# EAGLE design AOA (EAGLE 4.16)
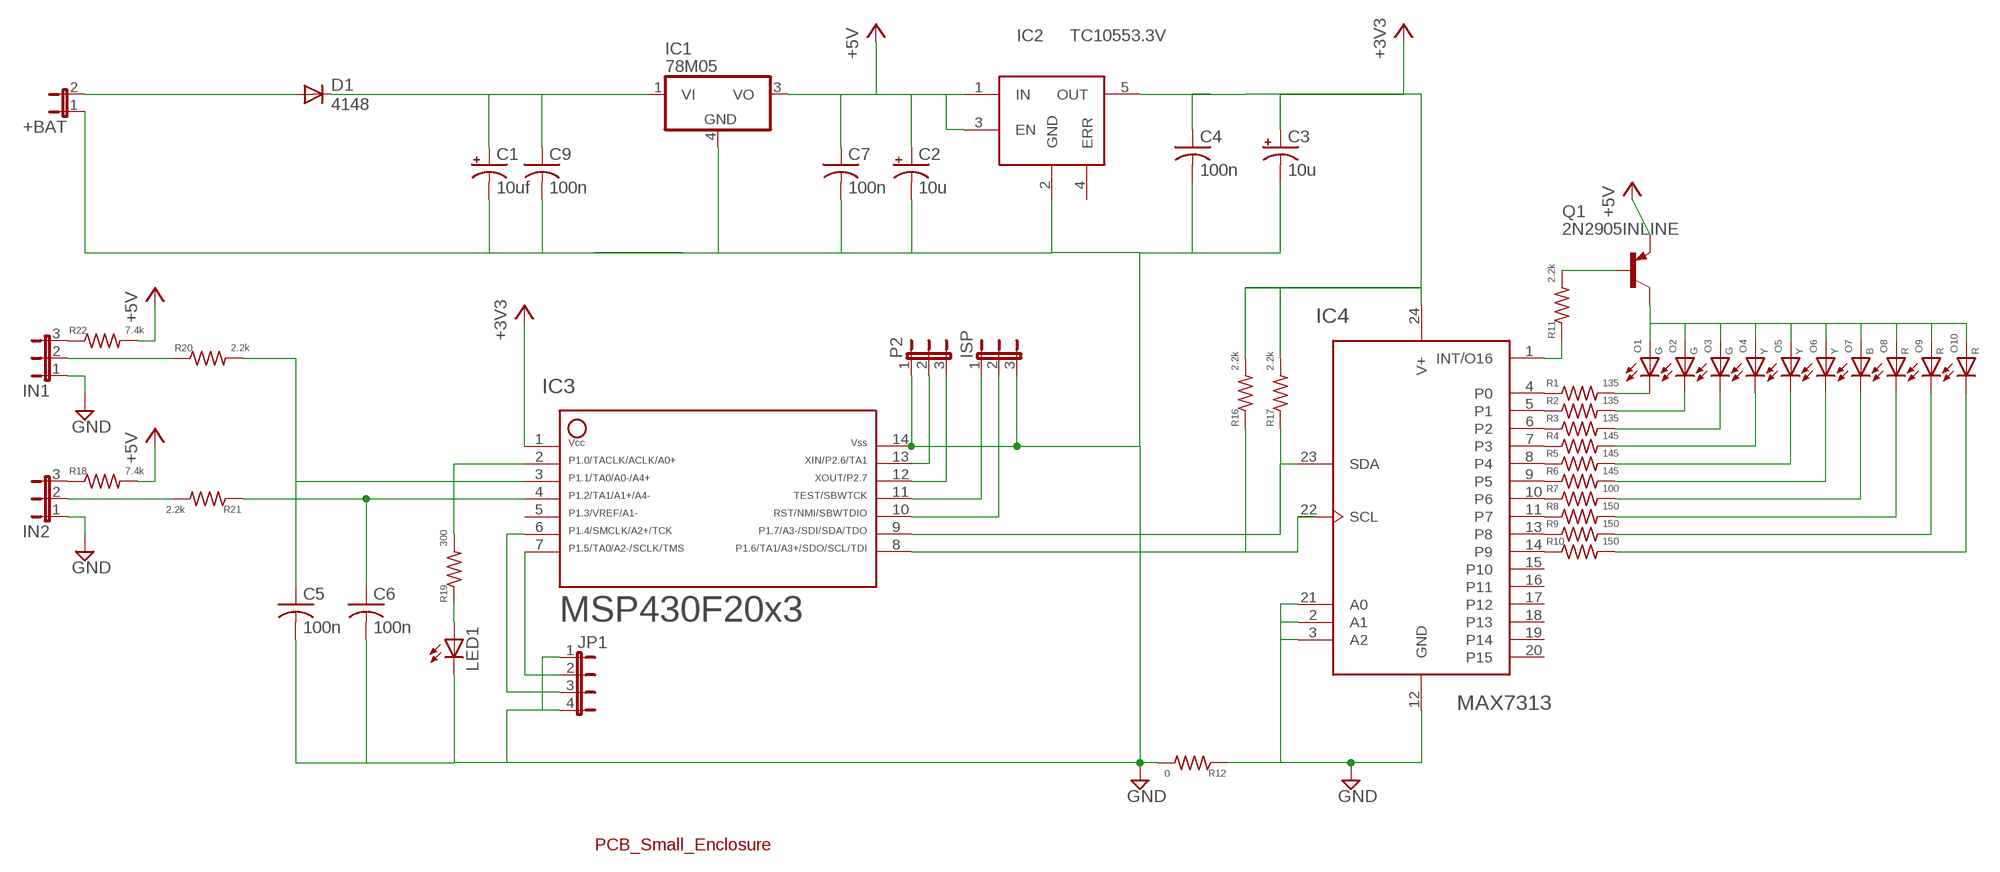
[diagram p0: schematic, sheet 1]

## Parts
+BAT  JP1E  [JP1]
C1  10uf  CPOL-USCT6032  [CT6032]
C2  10u  CPOL-USD/7343-31W  [D/7343-31W]
C3  10u  CPOL-USCT6032  [CT6032]
C4  100n  C-USC0805  [C0805]
C5  100n  C-USC1206  [C1206]
C6  100n  C-USC1206  [C1206]
C7  100n  C-USC0805  [C0805]
C9  100n  C-USC0805  [C0805]
D1  4148  DIODE-DO214BA  [DO214BA]
IC1  78M05  78MXXL  [DPACK]
IC2  TC10553.3V  [SOT23-5]
IC3  F20X3---N14  [N14]
IC4  MAX7313  [TSSOP024]
IN1  JP2E  [JP2]
IN2  JP2E  [JP2]
ISP  JP2E  [JP2]
JP1  JP4E  [JP4]
LED1  LEDCHIP-LED0805  [CHIP-LED0805]
O1  G  LED6X4  [LED6X4]
O2  G  LED6X4  [LED6X4]
O3  G  LED6X4  [LED6X4]
O4  Y  LED6X4  [LED6X4]
O5  Y  LED6X4  [LED6X4]
O6  Y  LED6X4  [LED6X4]
O7  B  LED6X4  [LED6X4]
O8  R  LED6X4  [LED6X4]
O9  R  LED6X4  [LED6X4]
O10  R  LED6X4  [LED6X4]
P2  JP2E  [JP2]
Q1  2N2905INLINE  [TO92-]
R1  135  R-US_R1206  [R1206]
R2  135  R-US_R1206  [R1206]
R3  135  R-US_R1206  [R1206]
R4  145  R-US_R1206  [R1206]
R5  145  R-US_R1206  [R1206]
R6  145  R-US_R1206  [R1206]
R7  100  R-US_R1206  [R1206]
R8  150  R-US_R1206  [R1206]
R9  150  R-US_R1206  [R1206]
R10  150  R-US_R1206  [R1206]
R11  2.2k  R-US_0207/10  [0207/10]
R12  0  R-US_0204/5  [0204/5]
R16  2.2k  R-US_0207/10  [0207/10]
R17  2.2k  R-US_0207/10  [0207/10]
R18  7.4k  R-US_0207/10  [0207/10]
R19  300  R-US_R0805  [R0805]
R20  2.2k  R-US_R0805  [R0805]
R21  2.2k  R-US_R0805  [R0805]
R22  7.4k  R-US_0207/10  [0207/10]
U$8  PCB_ENCLOSURE_SMALL  [PCB_SMALLENCLOSURE]

## Nets
+3V3: C3.+ C4.1 IC2.5(OUT) IC3.1 IC4.24(V+) R16.2 R17.2
+5V: C2.+ C7.1 IC1.3(VO) IC2.1(IN) IC2.3(EN) Q1.E R18.2 R22.2
GND: +BAT.1 C1.- C2.- C3.- C4.2 C5.2 C6.2 C7.2 C9.2 IC1.4(GND) IC2.2(GND) IC3.14 IC4.2(A1) IC4.3(A2) IC4.12(GND) IC4.21(A0) IN1.1 IN2.1 ISP.3 JP1.1 JP1.4 LED1.C P2.1 R12.1 R12.2
N$1: IC4.4(P0) R1.1
N$2: IC4.5(P1) R2.1
N$3: IC4.6(P2) R3.1
N$4: IC4.7(P3) R4.1
N$5: IC4.8(P4) R5.1
N$6: IC4.9(P5) R6.1
N$7: IC4.10(P6) R7.1
N$8: IC4.11(P7) R8.1
N$9: IC4.13(P8) R9.1
N$10: IC4.14(P9) R10.1
N$11: IC4.1(INT/O16) R11.1
N$12: O1.P$2(C) R1.2
N$13: O2.P$2(C) R2.2
N$14: O3.P$2(C) R3.2
N$15: O4.P$2(C) R4.2
N$16: O5.P$2(C) R5.2
N$17: O6.P$2(C) R6.2
N$18: O7.P$2(C) R7.2
N$19: O8.P$2(C) R8.2
N$20: O9.P$2(C) R9.2
N$21: O10.P$2(C) R10.2
N$23: Q1.B R11.2
N$24: IC3.13 P2.2
N$25: +BAT.2 D1.A
N$27: O1.P$1(A) O2.P$1(A) O3.P$1(A) O4.P$1(A) O5.P$1(A) O6.P$1(A) O7.P$1(A) O8.P$1(A) O9.P$1(A) O10.P$1(A) Q1.C
N$29: IC3.11 ISP.1
N$32: IC3.10 ISP.2
N$34: IC3.12 P2.3
N$36: C1.+ C9.1 D1.C IC1.1(VI)
N$37: IN2.2 R21.2
N$40: LED1.A R19.1
N$43: IN1.3 R22.1
N$44: IN1.2 R20.1
N$45: IN2.3 R18.1
P1_0: IC3.2 R19.2
P1_1: C5.1 IC3.3 R20.2
P1_2: C6.1 IC3.4 R21.1
P1_4: IC3.6 JP1.3
P1_5: IC3.7 JP1.2
SCL: IC3.8 IC4.22(SCL) R16.1
SDA: IC3.9 IC4.23(SDA) R17.1
Unconnected: IC2.4(ERR) IC3.5 IC4.15(P10) IC4.16(P11) IC4.17(P12) IC4.18(P13) IC4.19(P14) IC4.20(P15)

## Library data of the parts
+BAT = jumper:JP1E: JUMPER
C1-C3 = rcl:CPOL-US: POLARIZED CAPACITOR, American symbol
C4-C7 C9 = rcl:C-US: CAPACITOR, American symbol
D1 = diode:DIODE-: DIODE
IC1 = ZStofer:78MXXL: VOLTAGE REGULATOR
IC2 = ZStofer:TC10553.3V
IC3 = TI_MSP430_v12:F20X3---N14: ***MSP430F20x3***N14
IC4 = ZStofer:MAX7313: 8 Port I2C expander with LED intensity control
IN1 IN2 ISP P2 = jumper:JP2E: JUMPER
JP1 = jumper:JP4E: JUMPER
LED1 = led:LED: LED OSRAM: - CHIPLED LG R971, LG N971, LY N971, LG Q971, LY Q971, LO R971, LY R971 LH N974, LH R974 LS Q976, LO Q976, LY Q976 LO Q996 - Hyper CHIPLED LW Q18S LB Q993, LB Q99A, LB R99A - SideLED LS A670, LO A670, LY A670, LG A670, LP A670 LB A673, LV A673, LT A673, LW A673 LH A674 LY A675 LS A676, LA A676, LO A676, LY A676, LW A676 LS A679, LY A679, LG A679 - Hyper Micro SIDELED® LS Y876, LA Y876, LO Y876, LY Y876 LT Y87S - SmartLED LW L88C, LW L88S LB L89C, LB L89S, LG L890 LS L89K, LO L89K, LY L89K LS L896, LA L896, LO L896, LY L896 - TOPLED LS T670, LO T670, LY T670, LG T670, LP T670 LSG T670, LSP T670, LSY T670, LOP T670, LYG T670 LG T671, LOG T671, LSG T671 LB T673, LV T673, LT T673, LW T673 LH T674 LS T676, LA T676, LO T676, LY T676, LB T676, LH T676, LSB T676, LW T676 LB T67C, LV T67C, LT T67C, LS T67K, LO T67K, LY T67K, LW E67C LS E67B, LA E67B, LO E67B, LY E67B, LB E67C, LV E67C, LT E67C LW T67C LS T679, LY T679, LG T679 LS T770, LO T770, LY T770, LG T770, LP T770 LB T773, LV T773, LT T773, LW T773 LH T774 LS E675, LA E675, LY E675, LS T675 LS T776, LA T776, LO T776, LY T776, LB T776 LHGB T686 LT T68C, LB T68C - Hyper Mini TOPLED® LB M676 - Mini TOPLED Santana® LG M470 LS M47K, LO M47K, LY M47K Source: http://www.osram.convergy.de - LUMILED® LXK2-PW12-R00, LXK2-PW12-S00, LXK2-PW14-U00, LXK2-PW14-V00 LXK2-PM12-R00, LXK2-PM12-S00, LXK2-PM14-U00 LXK2-PE12-Q00, LXK2-PE12-R00, LXK2-PE12-S00, LXK2-PE14-T00, LXK2-PE14-U00 LXK2-PB12-K00, LXK2-PB12-L00, LXK2-PB12-M00, LXK2-PB14-N00, LXK2-PB14-P00, LXK2-PB14-Q00 LXK2-PR12-L00, LXK2-PR12-M00, LXK2-PR14-Q00, LXK2-PR14-R00 LXK2-PD12-Q00, LXK2-PD12-R00, LXK2-PD12-S00 LXK2-PH12-R00, LXK2-PH12-S00 LXK2-PL12-P00, LXK2-PL12-Q00, LXK2-PL12-R00 Source: www.luxeon.com
O1-O10 = ZStofer:LED6X4
Q1 = ZStofer:2N2905*: PNP Transistror
R1-R12 R16-R22 = rcl:R-US_: RESISTOR, American symbol
U$8 = ZStofer:PCB_ENCLOSURE_SMALL

## Board
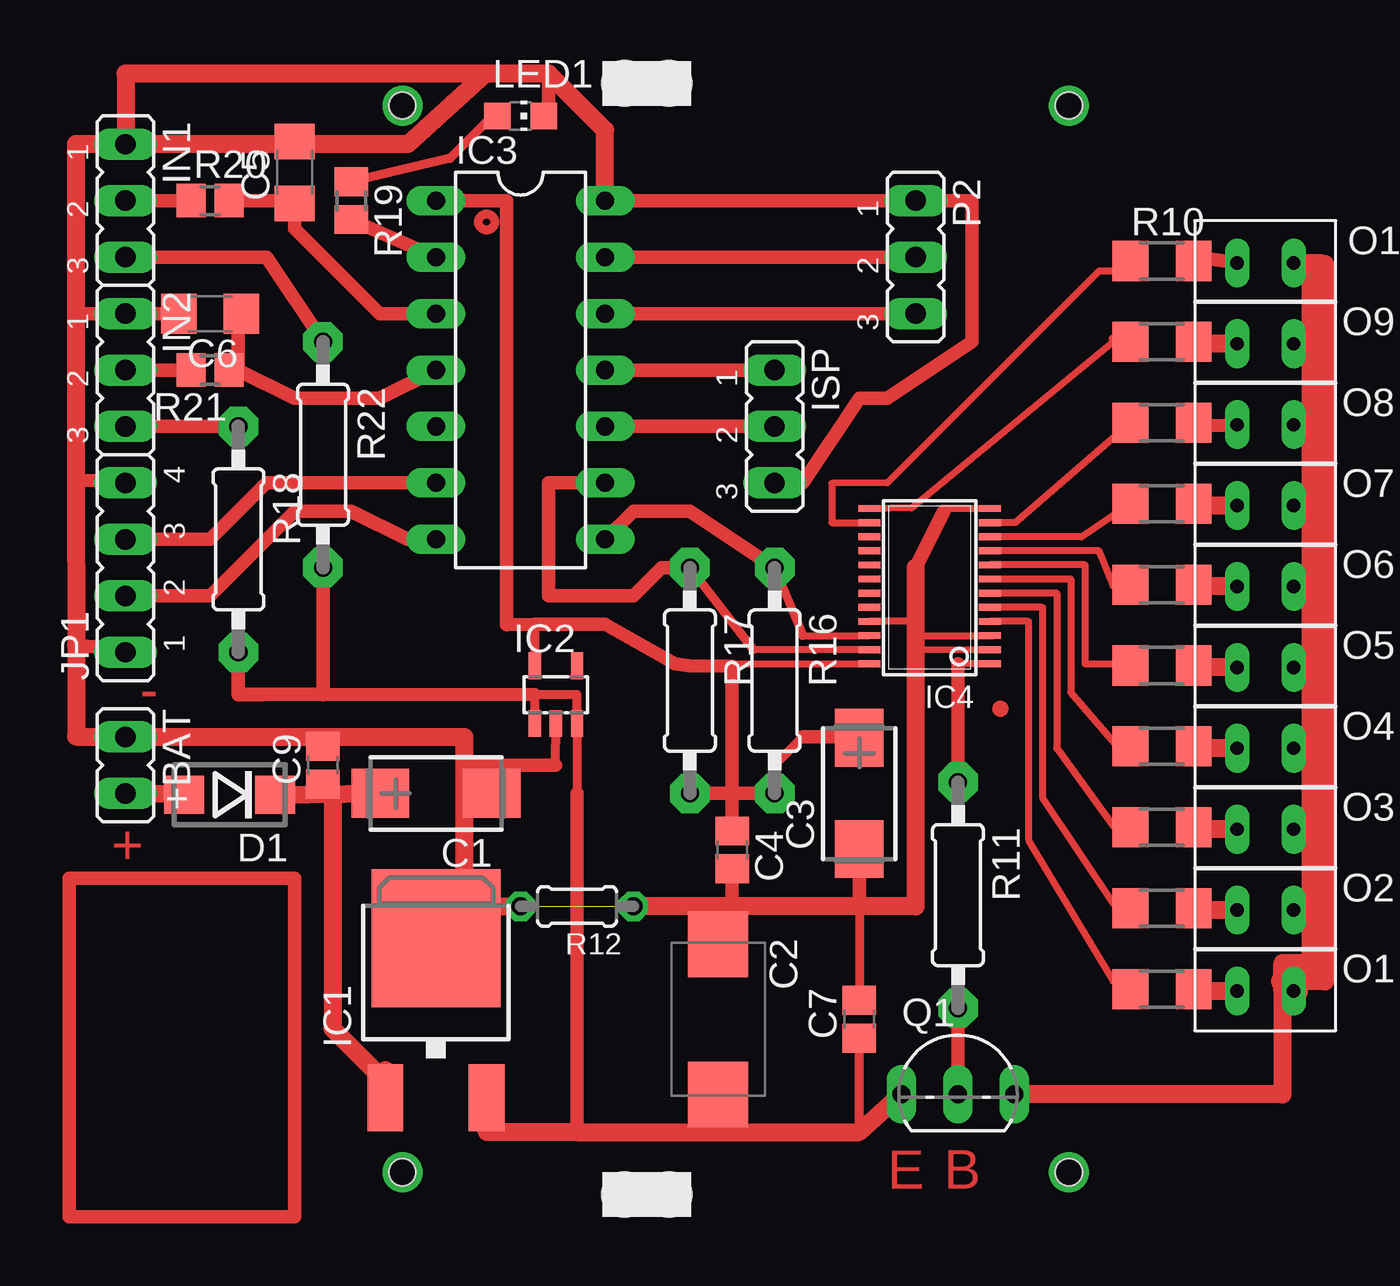
[diagram p1: board, top side]

No outline drawn. Coordinates in mm, seen from the top.
Copper layers (1*2+15*16): Top 0.035mm / dielectric 0.2mm / Route2 0.035mm / dielectric 0.15mm / Route15 0.035mm / dielectric 0.2mm / Bottom 0.035mm
Design rules "default": minimum track width 10mil, minimum drill 24mil, track to track 8mil, track to pad 8mil, pad to pad 8mil, via to via 8mil, smd to smd 8mil, copper to edge 40mil, drill to drill 8mil, minimum pad ring 10mil, minimum via ring 8mil, stop-mask expansion 4mil, vias tented up to drill 0mil, thermal gap 10mil

### Footprints (pad centres in the part's own frame; a part is rotated, then mirrored left to right if it is on the bottom)
JP1 = drill 0.914 long: 1 0,-1.27; 2 0,1.27
CT6032 = smd 2.6 x 2.2: + 2.5,0; - -2.5,0
D/7343-31W = smd 2.95 x 2.7: + 3.375,0; - -3.375,0
C0805 = smd 1.3 x 1.5: 1 -0.85,0; 2 0.85,0
C1206 = smd 1.6 x 1.8: 1 -1.4,0; 2 1.4,0
DO214BA = smd 1.8 x 1.7: A 2.05,0; C -2.05,0
DPACK = smd 1.6 x 3: 1 -2.28,-4.8; 3 2.28,-4.8 | smd 5.8 x 6.2: 4 0,2.38
SOT23-5 = smd 0.55 x 1.2: 1 -0.95,-1.3; 2 0,-1.3; 3 0.95,-1.3; 4 0.95,1.3; 5 -0.95,1.3
N14 = drill 0.813 long: 1 -8.89,-3.81; 2 -6.35,-3.81; 3 -3.81,-3.81; 4 -1.27,-3.81; 5 1.27,-3.81; 6 3.81,-3.81; 7 6.35,-3.81; 8 6.35,3.81; 9 3.81,3.81; 10 1.27,3.81; 11 -1.27,3.81; 12 -3.81,3.81; 13 -6.35,3.81; 14 -8.89,3.81
TSSOP024 = smd 0.305 x 0.991: 1 -3.493,-2.718; 2 -2.857,-2.718; 3 -2.223,-2.718; 4 -1.587,-2.718; 5 -0.953,-2.718; 6 -0.318,-2.718; 7 0.318,-2.718; 8 0.953,-2.718; 9 1.587,-2.718; 10 2.223,-2.718; 11 2.857,-2.718; 12 3.493,-2.718; 13 3.493,2.718; 14 2.857,2.718; 15 2.223,2.718; 16 1.587,2.718; 17 0.953,2.718; 18 0.318,2.718; 19 -0.318,2.718; 20 -0.953,2.718; 21 -1.587,2.718; 22 -2.223,2.718; 23 -2.857,2.718; 24 -3.493,2.718
JP2 = drill 0.914 long: 1 -2.54,0; 2 0,0; 3 2.54,0
JP4 = drill 0.914 long: 1 -3.81,0; 2 -1.27,0; 3 1.27,0; 4 3.81,0
CHIP-LED0805 = smd 1.2 x 1.2: A 0,-1.05; C 0,1.05
LED6X4 = drill 0.6 long: P$1 1.905,1.905; P$2 4.445,1.905
TO92- = drill 0.813 long: B 0,-1.27; C 2.54,-1.27; E -2.54,-1.27
R1206 = smd 1.6 x 1.803: 1 -1.422,0; 2 1.422,0
0207/10 = drill 0.813 pad 1.778 octagon: 1 -5.08,0; 2 5.08,0
0204/5 = drill 0.813 octagon: 1 -2.54,0; 2 2.54,0
R0805 = smd 1.3 x 1.5: 1 -0.85,0; 2 0.85,0
PCB_SMALLENCLOSURE = drill 1.2 round: P$1 15,50; P$2 45,50; P$3 15,2; P$4 45,2 | hole 1.2: 45,2; 45,50; 15,50; 15,2 | hole 2: 25,1; 27,1; 25,51; 27,51

### Placement (x,y rotation side)
+BAT  -11.43,-158.75 180 top
C1  2.54,-160.02 180 top
C2  15.24,-170.18 270 top
C3  21.59,-160.02 90 top
C4  15.88,-162.56 270 top
C5  -3.81,-132.08 90 top
C6  -7.62,-138.43 180 top
C7  21.59,-170.18 90 top
C9  -2.54,-158.75 90 top
D1  -6.75,-160.08 180 top
IC1  2.54,-168.91 0 top
IC2  7.94,-155.57 0 top
IC3  6.35,-142.24 270 top
IC4  24.77,-150.69 90 top
IN1  -11.43,-133.35 270 top
IN2  -11.43,-140.97 270 top
ISP  17.78,-143.51 270 top
JP1  -11.43,-149.86 90 top
LED1  6.35,-129.54 270 top
O1  43.05,-167 180 top
O2  43.05,-163.36 180 top
O3  43.05,-159.72 180 top
O4  43.05,-156.08 180 top
O5  43.05,-152.44 180 top
O6  43.05,-148.8 180 top
O7  43.05,-145.16 180 top
O8  43.05,-141.52 180 top
O9  43.05,-137.88 180 top
O10  43.05,-134.24 180 top
P2  24.13,-135.89 270 top
Q1  26.04,-172.28 0 top
R1  35.22,-168.82 0 top
R2  35.22,-165.18 0 top
R3  35.22,-161.54 0 top
R4  35.22,-157.9 0 top
R5  35.22,-154.26 0 top
R6  35.22,-150.62 0 top
R7  35.22,-146.98 0 top
R8  35.22,-143.34 0 top
R9  35.22,-139.7 0 top
R10  35.22,-136.06 0 top
R11  26.04,-164.59 270 top
R12  8.89,-165.1 180 top
R16  17.78,-154.94 270 top
R17  13.97,-154.94 270 top
R18  -6.35,-148.59 270 top
R19  -1.27,-133.35 270 top
R20  -7.62,-133.35 0 top
R21  -7.62,-140.97 180 top
R22  -2.54,-144.78 270 top
U$8  -13.97,-179.07 0 top

### Tracks (layer width: path | path; a pad name or v marks a point on that pad's centre or on a via)
+3V3
  Top 0.305: 13.31,-154.19 IC4.24 | 5.72,-152.42 5.74,-152.42
  Top 0.406: R16.2 17.78,-158.75 19.05,-157.48 | 6.99,-152.42 6.99,-152.4 IC2.5
  Top 0.61: 5.72,-152.42 5.71,-133.35 IC3.1 | 5.74,-152.42 6.99,-152.42 10.16,-152.4 13.31,-154.19 13.93,-154.28 15.88,-154.31 15.88,-160.02 | 15.88,-160.02 R17.2 | 15.88,-160.02 R16.2 | C3.+ 21.59,-157.48 19.05,-157.48 | 15.88,-160.02 C4.1
+5V
  Top 0.305: IC2.3 8.89,-156.84
  Top 0.406: IC2.1 6.99,-155.57 8.89,-155.57 8.89,-156.84 | IC2.3 8.89,-160.02 | 15.24,-175.26 C2.+ | 21.59,-175.26 C7.1
  Top 0.61: 8.89,-160.02 8.89,-175.26 | 6.99,-155.57 -2.54,-155.57 | -2.54,-155.57 -5.25,-155.56 | -5.25,-155.56 -6.07,-155.56 | -2.54,-155.57 | R22.2 -2.54,-155.57 | -5.25,-155.56 -5.25,-155.57 -6.35,-155.57 R18.2
  Top 0.813: Q1.E 21.59,-175.26 15.24,-175.26 8.89,-175.26 4.82,-175.26 IC1.3
GND  (1 unrouted)
  Top 0.305: 27.62,-152.92 IC4.3 24.14,-152.92 24.13,-152.92 | 25.4,-147.32 25.43,-147.21 IC4.12 | 24.13,-153.54 24.29,-153.54 IC4.2 | 24.13,-152.28 24.12,-152.28 IC4.21
  Top 0.406: 6.66,-158.82 7.93,-158.75 IC2.2 | 15.24,-165.1 C2.- | 21.59,-165.1 C7.2
  Top 0.61: IC3.14 P2.1 26.67,-133.35 26.67,-139.7 22.86,-142.24 21.59,-142.24 19.05,-146.05 ISP.3 | -13.67,-138.43 IN2.1 C6.2 | 1.27,-165.1 2.54,-167.64 | 7.93,-158.75 3.81,-158.75 5.08,-160.02 C1.- | 25.4,-147.32 24.13,-149.86 | 21.59,-165.1 C3.- | 15.88,-165.1 C4.2 | -13.36,-153.54 -13.65,-153.36 -11.56,-153.54 JP1.1 | JP1.4 -11.51,-145.97 -13.67,-145.93 | LED1.C 7.62,-129.54 7.62,-127.64 | 1.27,-130.81 C5.2 | -2.54,-157.48 C9.2
  Top 0.813: IC3.14 10.16,-130.18 7.62,-127.64 4.76,-127.64 | 4.76,-127.64 1.27,-130.81 IN1.1 | IN1.1 -13.67,-130.81 -13.67,-138.43 -13.67,-145.93 -13.65,-153.36 -13.65,-157.47 +BAT.1 -2.54,-157.48 3.81,-157.48 3.81,-158.75 3.81,-166.37 2.54,-166.37 IC1.4 | 4.76,-127.64 -11.43,-127.64 IN1.1 | IC1.4 1.27,-165.42 | IC1.4 1.27,-165.1 R12.2 | R12.1 15.24,-165.1 15.88,-165.1 21.59,-165.1 24.13,-165.1 24.13,-153.54 24.13,-152.92 24.13,-152.28 24.13,-149.86
N$1
  Top 0.305: IC4.4 29.21,-152.28 29.21,-162.12 33.02,-168.47 R1.1
N$2
  Top 0.305: IC4.5 29.84,-151.65 29.84,-160.22 33.02,-164.98 R2.1
N$3
  Top 0.305: IC4.6 30.48,-151.01 30.48,-158 33.02,-161.49 R3.1
N$4
  Top 0.305: IC4.7 31.11,-150.38 31.11,-155.46 33.09,-157.75 R4.1
N$5
  Top 0.305: R5.1 33.26,-154.26 33.34,-154.19 31.75,-154.19 31.75,-149.74 IC4.8
N$6
  Top 0.305: IC4.9 32.38,-149.11 33.02,-150.69 R6.1
N$7
  Top 0.305: R7.1 31.61,-148.47 IC4.10
N$8
  Top 0.305: R8.1 28.6,-147.84 IC4.11
N$9
  Top 0.305: 33.34,-139.9 33.14,-139.7 R9.1 33.02,-139.7 23.96,-147.17 IC4.13
  Top 0.406: 33.02,-139.58 R9.1
N$10
  Top 0.305: IC4.14 22.23,-147.84 20.36,-147.83 20.36,-146.06 22.86,-146.05 32.38,-136.53 33.66,-136.53
  Top 0.406: 34.29,-135.89 R10.1 33.66,-136.2 33.66,-136.53
N$11
  Top 0.305: 27.62,-154.19 IC4.1 26.04,-154.19
  Top 0.61: 26.04,-154.19 R11.1
N$12
  Top 0.813: 36.83,-168.91 36.83,-168.82 R1.2 | O1.P$2 36.83,-168.91 | 36.83,-168.91
N$13
  Top 0.813: 36.83,-165.18 36.83,-165.1 | 36.83,-165.18 R2.2 | O2.P$2 36.83,-165.27 36.83,-165.18
N$14
  Top 0.813: 36.83,-161.63 36.83,-161.54 R3.2 | O3.P$2 36.83,-161.63 | 36.83,-161.63 36.83,-161.93
N$15
  Top 0.813: 36.83,-157.99 36.83,-157.9 R4.2 | O4.P$2 36.83,-157.99 | 36.83,-157.99 36.83,-158.12
N$16
  Top 0.813: R5.2 36.83,-154.26 36.83,-154.35 O5.P$2
N$17
  Top 0.61: R6.2 36.83,-150.5 36.83,-150.71
  Top 0.813: O6.P$2 36.83,-150.71 36.83,-151.13
N$18
  Top 0.813: 36.83,-147.07 36.83,-146.98 R7.2 | O7.P$2 36.83,-147.07 | 36.83,-147.07 36.83,-147.32
N$19
  Top 0.61: R8.2 36.83,-143.51 O8.P$2
N$20
  Top 0.813: 36.83,-139.7 | 36.83,-139.7 R9.2 | O9.P$2 36.83,-139.79 36.83,-139.7
N$21
  Top 0.61: R10.2 36.83,-135.89 O10.P$2
N$23
  Top 0.61: R11.2 Q1.B
N$24
  Top 0.61: P2.2 IC3.13
N$25
  Top 0.813: D1.A +BAT.2
N$26
  Top 0.61: -3.81,-163.83 -13.97,-163.83 -13.97,-179.07 -3.81,-179.07 -3.81,-163.83
N$27
  Top 0.61: 41.51,-168.47 41.13,-168.86 41.14,-168.87 O1.P$1 40.64,-168.47 | 42.55,-165.08 42.37,-165.27 | 42.55,-161.63 42.6,-161.63 42.59,-161.63 | 42.55,-158 42.54,-157.99 | 42.55,-154.46 42.44,-154.35 | 42.55,-150.64 42.49,-150.71 | 42.55,-147.24 42.6,-147.24 42.43,-147.07 | 42.55,-143.51 42.51,-143.51 42.42,-143.43 | 42.55,-139.79 42.51,-139.79 | 42.55,-136.2 42.42,-136.2 42.36,-136.15
  Top 0.813: 41.91,-167.64 41.91,-136.53 | 41.91,-167.64 41.91,-168.28 | 41.91,-167.64 40.64,-167.64 40.64,-168.91 | 42.55,-136.2 42.55,-139.79 42.55,-143.51 42.55,-147.24 42.55,-150.64 42.55,-154.46 42.55,-158 42.55,-161.63 42.55,-165.08 42.55,-168.47 41.51,-168.47 | 42.37,-165.27 O2.P$1 | 42.59,-161.63 O3.P$1 | 42.54,-157.99 O4.P$1 | 42.44,-154.35 O5.P$1 | 42.49,-150.71 O6.P$1 | 42.43,-147.07 O7.P$1 | 42.42,-143.43 O8.P$1 | 42.51,-139.79 O9.P$1 | O10.P$1 42.36,-136.15 | Q1.C 40.64,-173.55 40.64,-168.91 | 40.64,-168.47 40.64,-168.91
  Top 1.016: 40.64,-168.47 41.27,-168.91 O1.P$1
N$29
  Top 0.61: ISP.1 IC3.11
N$32
  Top 0.61: ISP.2 IC3.10
N$34
  Top 0.61: P2.3 IC3.12
N$36
  Top 0.61: C9.1 -2.54,-160.02 -2.12,-160.02 -5.08,-160.02 D1.C
  Top 0.813: IC1.1 0.26,-172.46 0,-172.72 -2.12,-170.6 -2.12,-160.02 | D1.C C1.+
N$37
  Top 0.61: R21.2 IN2.2
N$40
  Top 0.406: R19.1 3.17,-131.44 5.08,-129.54 LED1.A
N$43
  Top 0.61: IN1.3 -5.08,-135.89 R22.1
N$44
  Top 0.61: R20.1 IN1.2
N$45
  Top 0.61: R18.1 IN2.3
P1_0
  Top 0.61: IC3.2 R19.2
P1_1
  Top 0.61: IC3.3 0,-138.43 -3.81,-134.62 C5.1 -3.81,-133.35 R20.2
P1_2
  Top 0.61: IC3.4 0,-142.24 -3.81,-142.24 -6.35,-140.97 | -6.35,-140.97 R21.1 | -6.35,-140.97 -6.35,-138.43 C6.1
P1_4
  Top 0.61: IC3.6 -5.08,-146.05 -7.62,-148.59 JP1.3
P1_5
  Top 0.61: IC3.7 1.27,-148.59 -1.27,-147.32 -3.81,-147.32 -7.62,-151.13 JP1.2
SCL
  Top 0.305: 19.05,-152.92 IC4.22
  Top 0.406: R16.1 19.05,-152.92
  Top 0.61: R16.1 13.97,-147.32 11.43,-147.32 IC3.8
SDA
  Top 0.305: IC3.9 8.26,-146.05 | 22.23,-153.55 IC4.23 16.83,-153.55
  Top 0.406: 16.83,-153.55 R17.1
  Top 0.61: IC3.9 7.62,-146.05 7.62,-151.13 11.43,-151.13 12.7,-149.86 R17.1
(copper drawn outside any net)
  shapes: Top circle x2

### Text on the board
Top: - | + | E | B